# Altium project plp_com_u2.PrjPcb
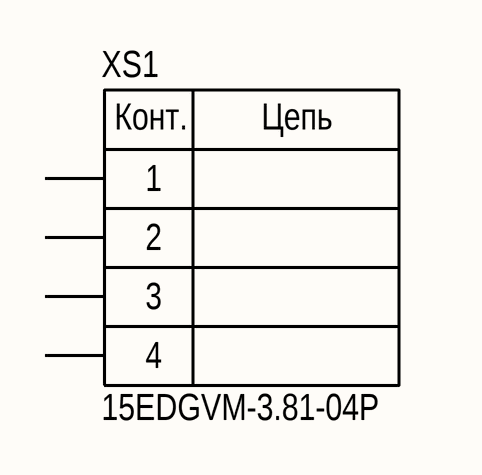
[diagram p0: plp_com_u2.SchDoc]
1 sheet, 1 parts. Net scope: global (net labels, ports and power ports of the same name join across sheets).
Board file: plp_com_u2.PcbDoc

## Sheet plp_com_u2.SchDoc: VISUR-R
size 420 x 297 mm; Address1: Address1; Address2: Address2; Address3: Address3; Address4: Address4; DocumentNumber: АБВГ.123456.001 Э3; SheetNumber: 1; Scale: 1:1; DocumentType: Схема электрическая принципиальная; FirstReferrence: АБВГ.123456.001

### Parts
XS1  15EDGVM-3.81-04P  [CON: 15EDGVM-3.81-04P(Long Pad)]

### Nets

Not connected (* = marked no-connect by the designer): XS1 1 2 3 4

### Notes on the sheet
- Перв. примен.
- Справ. №
- Подп. и дата
- Инв. № дубл.
- Взам. инв. №
- Разраб.
- Изм.
- Лист
- № докум.
- Подп.
- Дата
- Лит.
- Масса
- Масштаб
- Пров.
- Т.контр.
- Листов
- Инв. № подл.
- Утв.
- Н.контр.
- 2.106-A3
- Копировал
- Формат А3
- (in symbol 15EDGVM-3.81-04P) Конт.; Цепь

### Library data of the parts
XS1 = 15EDGVM-3.81-04P: ComponentLink1Description: Datasheet; ComponentLink1URL: http://files.xn--e1agecchai.xn--p1ai/pdf/15edgvm-3.81.pdf